# Altium project ESP32DevBoard.PrjPcb
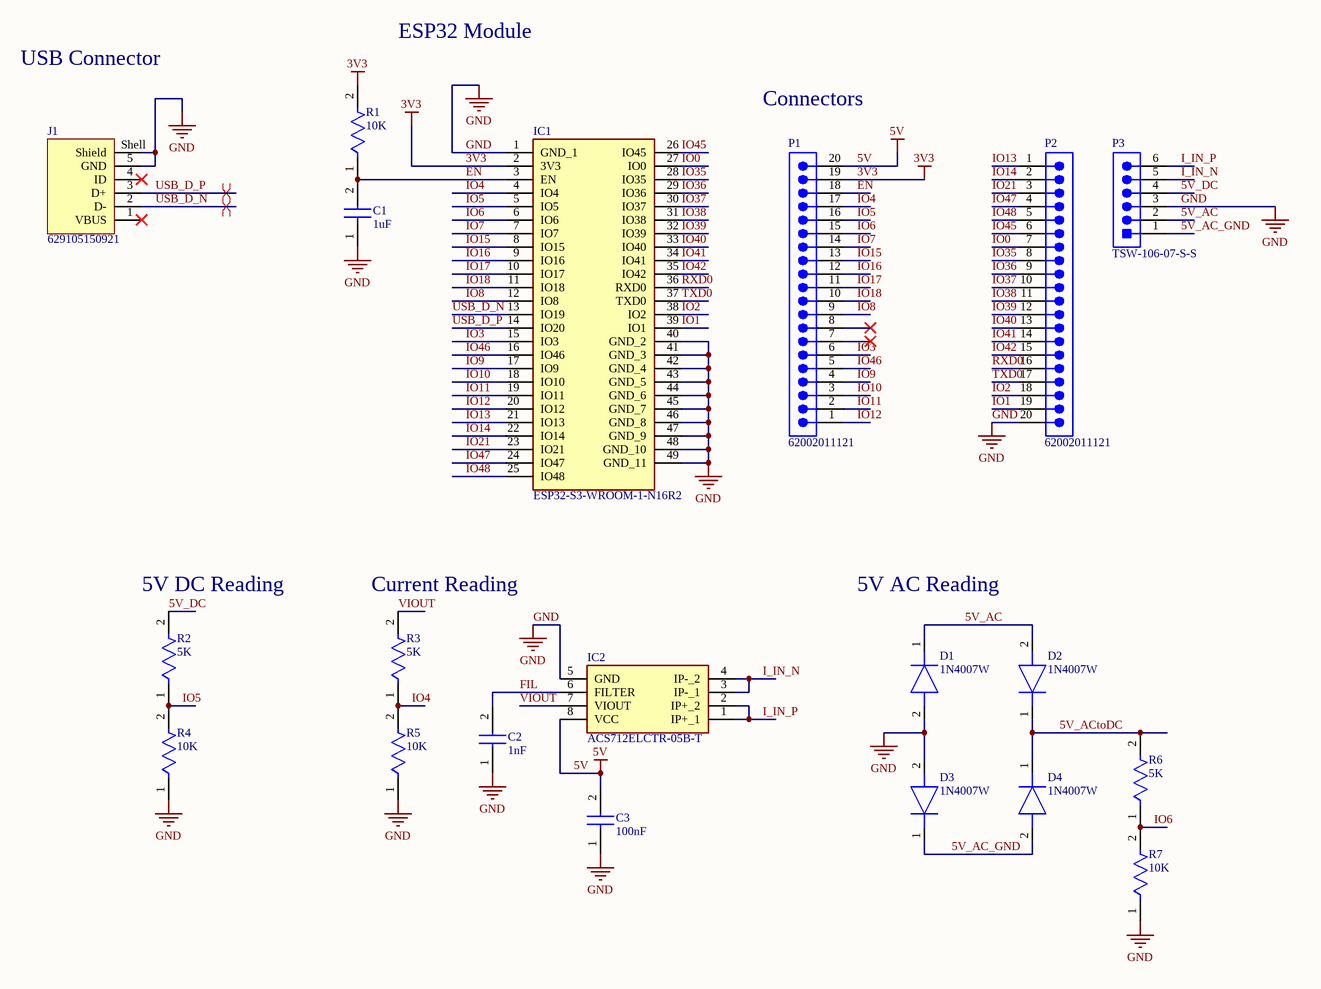
[diagram p0: Sheet1.SchDoc]
1 sheet, 20 parts. Net scope: global (net labels, ports and power ports of the same name join across sheets).
Board file: Sheet1.PcbDoc

## Sheet Sheet1.SchDoc
size B; SheetNumber: 1; SheetTotal: 1

### Parts
C1  1uF  [CAPC2012X88N]
C2  1nF  [CAPC2012X88N]
C3  100nF  [CAPC2012X88N]
D1  1N4007W  [1N4007W]
D2  1N4007W  [1N4007W]
D3  1N4007W  [1N4007W]
D4  1N4007W  [1N4007W]
IC1  ESP32-S3-WROOM-1-N16R2  [ESP32S3WROOM1N16R2]
IC2  ACS712ELCTR-05B-T  [SOIC127P600X175-8N]
J1  629105150921  [629105150921]
P1  62002011121  [62002011121]
P2  62002011121  [62002011121]
P3  TSW-106-07-S-S  [SMTC-TSW-106-07-S-S_V]
R1  10K  [FP-CRG0805-IPC_C]
R2  5K  [FP-CRG0805-IPC_C]
R3  5K  [FP-CRG0805-IPC_C]
R4  10K  [FP-CRG0805-IPC_C]
R5  10K  [FP-CRG0805-IPC_C]
R6  5K  [FP-CRG0805-IPC_C]
R7  10K  [FP-CRG0805-IPC_C]

### Nets
3V3: IC1.2(3V3) P1.19 R1.2
5V: C3.2 IC2.8(VCC) P1.20
GND: C1.1 C2.1 C3.1 D1.2(A) D3.2(A) IC1.1(GND_1) IC1.40(GND_2) IC1.41(GND_3) IC1.42(GND_4) IC1.43(GND_5) IC1.44(GND_6) IC1.45(GND_7) IC1.46(GND_8) IC1.47(GND_9) IC1.48(GND_10) IC1.49(GND_11) IC2.5(GND) J1.5(GND) J1.Shell(Shield) P2.20 P3.3 R4.1 R5.1 R7.1
5V_AC: D1.1(K) D2.2(A) P3.2
5V_AC_GND: D3.1(K) D4.2(A) P3.1
5V_ACtoDC: D2.1(K) D4.1(K) R6.2
5V_DC: P3.4 R2.2
EN: C1.2 IC1.3(EN) P1.18 R1.1
FIL: C2.2 IC2.6(FILTER)
I_IN_N: IC2.3(IP-_1) IC2.4(IP-_2) P3.5
I_IN_P: IC2.1(IP+_1) IC2.2(IP+_2) P3.6
IO0: IC1.27(IO0) P2.7
IO1: IC1.39(IO1) P2.19
IO2: IC1.38(IO2) P2.18
IO3: IC1.15(IO3) P1.6
IO4: IC1.4(IO4) P1.17 R3.1 R5.2
IO5: IC1.5(IO5) P1.16 R2.1 R4.2
IO6: IC1.6(IO6) P1.15 R6.1 R7.2
IO7: IC1.7(IO7) P1.14
IO8: IC1.12(IO8) P1.9
IO9: IC1.17(IO9) P1.4
IO10: IC1.18(IO10) P1.3
IO11: IC1.19(IO11) P1.2
IO12: IC1.20(IO12) P1.1
IO13: IC1.21(IO13) P2.1
IO14: IC1.22(IO14) P2.2
IO15: IC1.8(IO15) P1.13
IO16: IC1.9(IO16) P1.12
IO17: IC1.10(IO17) P1.11
IO18: IC1.11(IO18) P1.10
IO21: IC1.23(IO21) P2.3
IO35: IC1.28(IO35) P2.8
IO36: IC1.29(IO36) P2.9
IO37: IC1.30(IO37) P2.10
IO38: IC1.31(IO38) P2.11
IO39: IC1.32(IO39) P2.12
IO40: IC1.33(IO40) P2.13
IO41: IC1.34(IO41) P2.14
IO42: IC1.35(IO42) P2.15
IO45: IC1.26(IO45) P2.6
IO46: IC1.16(IO46) P1.5
IO47: IC1.24(IO47) P2.4
IO48: IC1.25(IO48) P2.5
RXD0: IC1.36(RXD0) P2.16
TXD0: IC1.37(TXD0) P2.17
USB_D_N: IC1.13(IO19) J1.2(D-)
USB_D_P: IC1.14(IO20) J1.3(D+)
VIOUT: IC2.7(VIOUT) R3.2

Not connected (* = marked no-connect by the designer): J1 1(VBUS)* 4(ID)*; P1 7* 8*

### Layout directives
differential pair: USB_D_N, USB_D_P

### Notes on the sheet
- ESP32 Module
- USB Connector
- Connectors
- (near R2) 5V DC Reading
- (near R3) Current Reading
- 5V AC Reading

### Library data of the parts
C1-C3 = C0805C104K5RAC7411: Capacitor; Manufacturer_Name: KEMET; Datasheet Link: https://www.mouser.com/datasheet/2/212/KEM_C1002_X7R_SMD-1102033.pdf; Height: 0.88mm; Manufacturer_Part_Number: C0805C104K5RAC7411; Mouser Part Number: 80-C0805C104K5RACLR; Mouser Price/Stock: https://www.mouser.co.uk/ProductDetail/KEMET/C0805C104K5RAC7411?qs=jbRM9o5BbzPcVXF0wW9AYg%3D%3D; Arrow Part Number: C0805C104K5RAC7411; Arrow Price/Stock: https://www.arrow.com/en/products/c0805c104k5rac7411/kemet-corporation
D1-D4 = 1N4007W: Diode; Manufacturer_Name: Jingdao Microelectronics; Datasheet Link: https://datasheet.lcsc.com/szlcsc/Shandong-Jingdao-Microelectronics-1N4007W_C108803.pdf; Height: 1.1mm; Manufacturer_Part_Number: 1N4007W
IC1 = ESP32-S3-WROOM-1-N16R2: Integrated Circuit; Manufacturer_Name: Espressif Systems; Datasheet Link: https://www.espressif.com/sites/default/files/documentation/esp32-s3-wroom-1_wroom-1u_datasheet_en.pdf; Height: 3.25mm; Manufacturer_Part_Number: ESP32-S3-WROOM-1-N16R2; Mouser Part Number: 356-ESP32S3WRM1N16R2; Mouser Price/Stock: https://www.mouser.co.uk/ProductDetail/Espressif-Systems/ESP32-S3-WROOM-1-N16R2?qs=Li%252BoUPsLEnvy1bxV65eH%2Fw%3D%3D
IC2 = ACS712ELCTR-05B-T: Integrated Circuit; Manufacturer_Name: Allegro Microsystems; Datasheet Link: https://www.allegromicro.com/~/media/Files/Datasheets/ACS712-Datasheet.ashx; Height: 1.75mm; Manufacturer_Part_Number: ACS712ELCTR-05B-T; Mouser Part Number: 250-712ELCTR05BT; Mouser Price/Stock: https://www.mouser.co.uk/ProductDetail/Allegro-MicroSystems/ACS712ELCTR-05B-T?qs=pUKx8fyJudDs65Rkshv5ug%3D%3D; Arrow Part Number: ACS712ELCTR-05B-T; Arrow Price/Stock: https://www.arrow.com/en/products/acs712elctr-05b-t/allegro-microsystems?utm_currency=USD&region=nac
J1 = CMP-1502-03249-5: NexarPartId: 52645114; Operating Supply Voltage: 30V; Insulation Resistance: 1GΩ; Connector Type: USB; Current Rating: 1.8A; Number of Contacts: 5; Gender: Receptacle; USB Standard: USB 2.0; Contact Resistance: 30mΩ; Orientation: Horizontal; Height: 2.82mm; Packaging: Tape and Reel; Features: Shielded; Voltage Rating: 30V; Mount: Horizontal, Surface Mount; Termination: SMD/SMT; Contact Plating: Gold; Contact Material: Gold; REACH SVHC: Unknown; Min Operating Temperature: -40°C; Max Operating Temperature: 85°C; Number of Pins: 5; RoHS: Compliant
P1 P2 = CMP-1502-00967-3: NexarPartId: 61924788; Gender: Male; Current Rating: 2A; Operating Supply Voltage: 200V; Contact Resistance: 20mΩ; Lead Pitch: 2mm; Orientation: Vertical; Number of Pins: 20; RoHS: Non-Compliant
P3 = CMP-1681-00007-2: Male Header, Pitch 2.54 mm, 1 x 6 Position, Height 8.38 mm, Tail Length 2.54 mm, -55 to 125 degC, RoHS, Bulk; Manufacturer: Samtec; Rows: 1; Contact Finish: Gold; Lead Pitch: 0.1 inch; Package Quantity: 1; Mounting Technology: Through Hole; ComponentLink1Description: Manufacturer URL; Contact Plating: Gold; DatasheetVersion: 12/2015; ComponentLink3Description: Package Specification; PackageDescription: Male Header, Pitch 2.54 mm, 1 x 6 Position, Height 8.38 mm, Tail Length 2.54 mm; Height: 8.38 mm; ComponentLink2Description: Datasheet; RoHSCompliant: true; Colour: Black; Packaging: Bulk; Min Operating Temperature: -55 degC; ComponentLink2URL: http://suddendocs.samtec.com/catalog_english/tsw_th.pdf; Mount: Through Hole; PackageReference: TSW-102-07-S-S; Pins: 6; Max Operating Temperature: 125 degC; ComponentLink3URL: http://suddendocs.samtec.com/prints/tsw-xxx-xx-x-x-xx-xxx-footprint.pdf; Length: 15.24 mm; Contact Material: Bronze; ComponentLink1URL: http://www.samtec.com/
R1-R7 = CMP-03211-011401-1: RES SMD 10K OHM 1% 1/8W 0805; Temperature Coefficient: 100ppm/°C; Power Rating: 125mW; Resistance: 10kR; Voltage Rating: 150V; Number of Resistors: 1; RoHS Compliant: Yes; Tolerance: 1%; Mount: Surface Mount; Radiation Hardening: No; Depth: 1.25mm; Termination: Solder; Series: CRG Series; Packaging: Tape and Reel; Number of Terminations: 2; Resistor Type: Thick Film; Length: 2mm; Height: 0.55mm; ELV: Compliant; Case/Package: 0805; Min Operating Temperature: -55°C; Max Operating Temperature: 125°C; Technology: THICK FILM